# Altium schematic sheet MS5611.SchDoc
size A; SheetNumber: 5; SheetTotal: 12
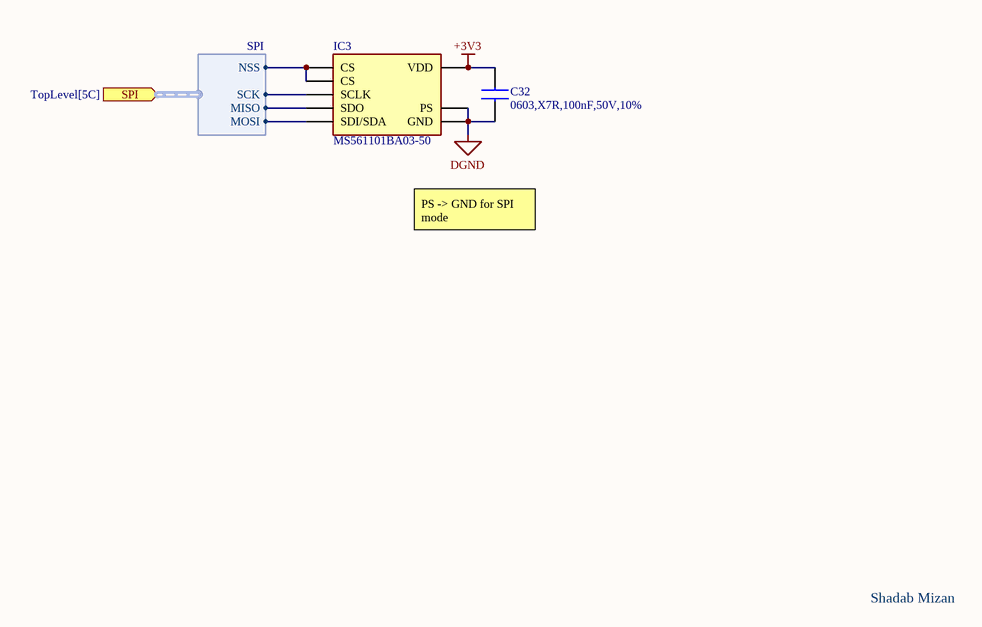
[diagram p0: MS5611.SchDoc]

## Parts
C32  0603,X7R,100nF,50V,10%  [CAPC1608X90N]
IC3  MS561101BA03-50  [MSI-MS561101BA03-50-8_V]

## Ports
SPI (in, harness SPI, see TopLevel[5C])

## Harnesses
SPI: NSS, SCK, MISO, MOSI

## Nets
+3V3: C32.2 IC3.1(VDD)
DGND: C32.1 IC3.2(PS) IC3.3(GND)
NetIC3_4: IC3.4(CS) IC3.5(CS) ; port SPI.NSS
NetIC3_6: IC3.6(SDO) ; port SPI.MISO
NetIC3_7: IC3.7(SDI/SDA) ; port SPI.MOSI
NetIC3_8: IC3.8(SCLK) ; port SPI.SCK

## Notes on the sheet
- PS -> GND for SPI mode
- Shadab Mizan

## Library data of the parts
C32 = CC0603KRX7R9BB104: 50V 100nF X7R ±10% 0603 Multilayer Ceramic Capacitors MLCC - SMD/SMT ROHS; LCSC Part #: C14663; Manu Part #: CC0603KRX7R9BB104
IC3 = MS561101BA03-50: Barometric Pressure Sensor, with Stainless Steel Cap, 1.8 to 3.6 V, -45 to 85 degC, 8-Pin QFN, RoHS, Tape and Reel; Manu Part #: MS561101BA03-50; LCSC Part #: C15639